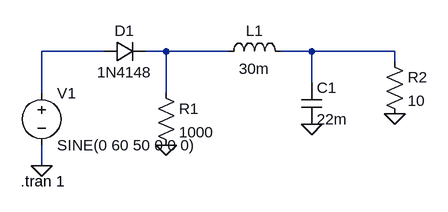
[diagram p0: schematic Draft3.asc]
Draft3.asc, the LTspice schematic file:
Version 4
SHEET 1 880 680
WIRE 176 64 80 64
WIRE 272 64 240 64
WIRE 368 64 272 64
WIRE 496 64 448 64
WIRE 624 64 496 64
WIRE 624 80 624 64
WIRE 496 112 496 64
WIRE 80 128 80 64
WIRE 272 128 272 64
WIRE 80 240 80 208
FLAG 80 240 0
FLAG 272 208 0
FLAG 496 176 0
FLAG 624 160 0
SYMBOL voltage 80 112 R0
WINDOW 123 24 124 Left 2
WINDOW 39 0 0 Left 0
SYMATTR InstName V1
SYMATTR Value SINE(0 60 50 0 0 0)
SYMBOL diode 176 80 R270
WINDOW 0 32 32 VTop 2
WINDOW 3 0 32 VBottom 2
SYMATTR InstName D1
SYMATTR Value 1N4148
SYMBOL res 256 112 R0
SYMATTR InstName R1
SYMATTR Value 1000
SYMATTR SpiceLine tol=5 pwr=0.25
SYMBOL ind 352 80 R270
WINDOW 0 32 56 VTop 2
WINDOW 3 5 56 VBottom 2
SYMATTR InstName L1
SYMATTR Value 30m
SYMBOL cap 480 112 R0
SYMATTR InstName C1
SYMATTR Value 22m
SYMBOL res 608 64 R0
SYMATTR InstName R2
SYMATTR Value 10
TEXT 48 264 Left 2 !.tran 1

The netlist it stands for:
* Draft3.asc
V1 N001 0 SINE(0 60 50 0 0 0)
D1 N001 N002 1N4148
R1 N002 0 1000 tol=5 pwr=0.25
L1 N002 N003 30m
C1 N003 0 22m
R2 N003 0 10
.model D D
.lib standard.dio
.tran 1
.backanno
.end